# Altium schematic sheet STM32F103C8T6.schdoc
size 127 x 101 mm
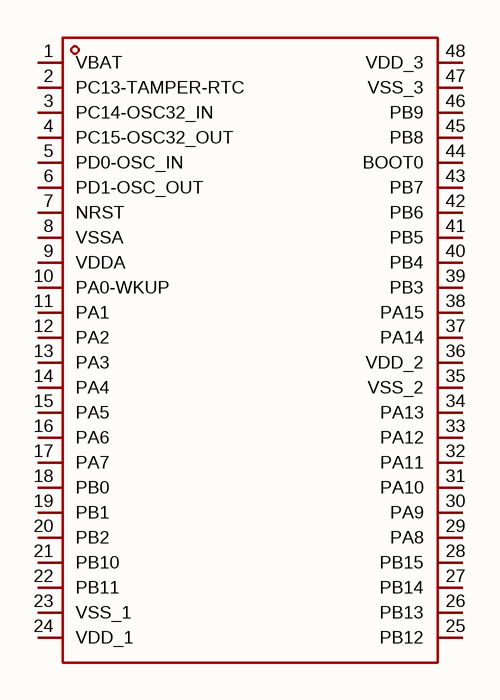
[diagram p0: STM32F103C8T6.schdoc]

## Parts
U?  stm32f103c8t6  [LQFP-48_L7.0-W7.0-P0.50-LS9.0-BL]  (value not drawn)

## Nets

Not connected (* = marked no-connect by the designer): U? 1(VBAT) 2(PC13-TAMPER-RTC) 3(PC14-OSC32_IN) 4(PC15-OSC32_OUT) 5(PD0-OSC_IN) 6(PD1-OSC_OUT) 7(NRST) 8(VSSA) 9(VDDA) 10(PA0-WKUP) 11(PA1) 12(PA2) 13(PA3) 14(PA4) 15(PA5) 16(PA6) 17(PA7) 18(PB0) 19(PB1) 20(PB2) 21(PB10) 22(PB11) 23(VSS_1) 24(VDD_1) 25(PB12) 26(PB13) 27(PB14) 28(PB15) 29(PA8) 30(PA9) 31(PA10) 32(PA11) 33(PA12) 34(PA13) 35(VSS_2) 36(VDD_2) 37(PA14) 38(PA15) 39(PB3) 40(PB4) 41(PB5) 42(PB6) 43(PB7) 44(BOOT0) 45(PB8) 46(PB9) 47(VSS_3) 48(VDD_3)

## Library data of the parts
U? = stm32f103c8t6: CPU内核:ARM-M3;CPU最大主频:72MHz;应用领域:-;; Manufacturer: ST(意法半导体); AddInBom: yes; ModelId: 093be70396ff421eb2cdb946d5311efc; ModelName: LQFP-48_L7.0-W7.0-H1.4-LS9.0-P0.50; ModelTransform: 354.331,354.331,0,0,0,0,0,0,0; CPU Core: ARM-M3; CPU Maximum Speed: 72MHz; Program Storage Size: 64KB; Program Memory Type: FLASH; Number of I/O: 37; ADC (Bit): 12bit; Voltage - Supply: 2V~3.6V; Symbol: STM32F103C8T6; LCSC Part Name: 主流增强型ARM Cortex-M3 MCU，具有64 KB Flash、72 MHz CPU、电机控制、USB和CAN; SupplierPart: C8734; ManufacturerPart: STM32F103C8T6; Supplier Footprint: LQFP-48(7x7); JLCPCB Part Class: Extended Part; Datasheet: https://item.szlcsc.com/datasheet/STM32F103C8T6/9243.html; Supplier: LCSC; ConvertToPcb: yes; FootprintName: LQFP-48_L7.0-W7.0-P0.50-LS9.0-BL; Applications: -